# Altium project 2mL Smart Parts Storage V1.PrjPcb
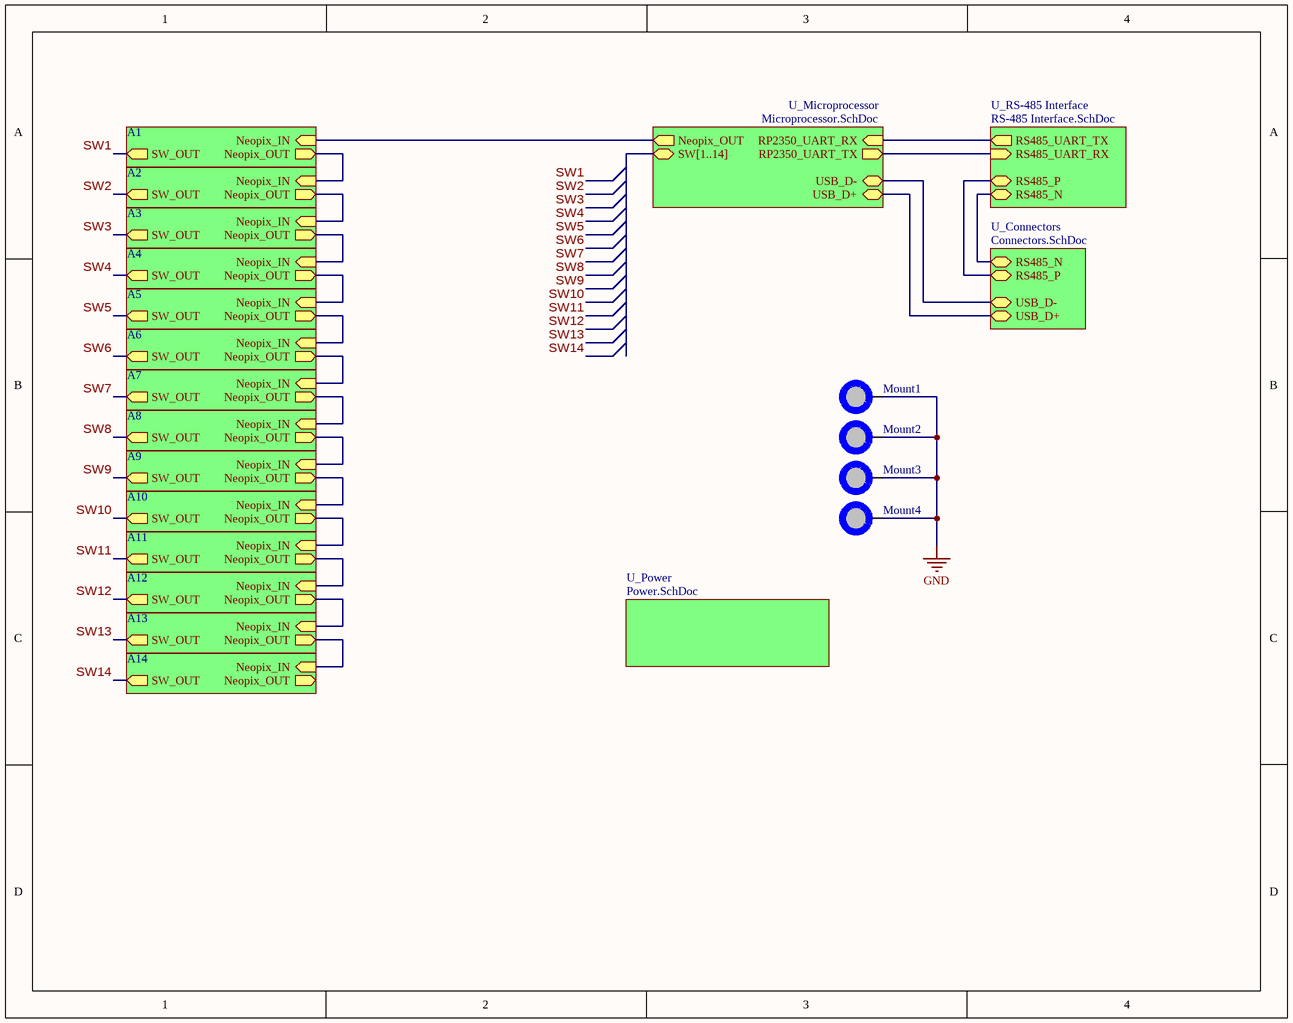
[diagram p0: Top Level.SchDoc]
6 sheets, 83 parts. Net scope: hierarchical (ports join the sheet entries above them; power ports are global).
Board file: Layout.PcbDoc
Sheets:
  Top Level.SchDoc
    U_Microprocessor = Microprocessor.SchDoc
    U_Connectors = Connectors.SchDoc
    U_RS-485 Interface = RS-485 Interface.SchDoc
    A1 = 2mL Socket.SchDoc
    A2 = 2mL Socket.SchDoc
    A3 = 2mL Socket.SchDoc
    A4 = 2mL Socket.SchDoc
    A5 = 2mL Socket.SchDoc
    A6 = 2mL Socket.SchDoc
    A7 = 2mL Socket.SchDoc
    A8 = 2mL Socket.SchDoc
    A9 = 2mL Socket.SchDoc
    A10 = 2mL Socket.SchDoc
    A11 = 2mL Socket.SchDoc
    A12 = 2mL Socket.SchDoc
    A13 = 2mL Socket.SchDoc
    A14 = 2mL Socket.SchDoc
    U_Power = Power.SchDoc

## Sheet Top Level.SchDoc
size A; SheetNumber: 1; SheetTotal: 6

### Parts
Mount1  M3 Mount Hole  [[Mount] M3 Mount Hole]  (value not drawn)  (no BOM)
Mount2  M3 Mount Hole  [[Mount] M3 Mount Hole]  (value not drawn)  (no BOM)
Mount3  M3 Mount Hole  [[Mount] M3 Mount Hole]  (value not drawn)  (no BOM)
Mount4  M3 Mount Hole  [[Mount] M3 Mount Hole]  (value not drawn)  (no BOM)

### Sub-sheets
A1 = 2mL Socket.SchDoc: SW_OUT (out), Neopix_IN (in), Neopix_OUT (out)
A2 = 2mL Socket.SchDoc: SW_OUT (out), Neopix_IN (in), Neopix_OUT (out)
A3 = 2mL Socket.SchDoc: SW_OUT (out), Neopix_IN (in), Neopix_OUT (out)
A4 = 2mL Socket.SchDoc: SW_OUT (out), Neopix_IN (in), Neopix_OUT (out)
A5 = 2mL Socket.SchDoc: SW_OUT (out), Neopix_IN (in), Neopix_OUT (out)
A6 = 2mL Socket.SchDoc: SW_OUT (out), Neopix_IN (in), Neopix_OUT (out)
A7 = 2mL Socket.SchDoc: SW_OUT (out), Neopix_IN (in), Neopix_OUT (out)
A8 = 2mL Socket.SchDoc: SW_OUT (out), Neopix_IN (in), Neopix_OUT (out)
A9 = 2mL Socket.SchDoc: SW_OUT (out), Neopix_IN (in), Neopix_OUT (out)
A10 = 2mL Socket.SchDoc: SW_OUT (out), Neopix_IN (in), Neopix_OUT (out)
A11 = 2mL Socket.SchDoc: SW_OUT (out), Neopix_IN (in), Neopix_OUT (out)
A12 = 2mL Socket.SchDoc: SW_OUT (out), Neopix_IN (in), Neopix_OUT (out)
A13 = 2mL Socket.SchDoc: SW_OUT (out), Neopix_IN (in), Neopix_OUT (out)
A14 = 2mL Socket.SchDoc: SW_OUT (out), Neopix_IN (in), Neopix_OUT (out)
U_Connectors = Connectors.SchDoc: RS485_P (bidir), RS485_N (bidir), USB_D+ (bidir), USB_D- (bidir)
U_Microprocessor = Microprocessor.SchDoc: SW[1..14] (bidir), RP2350_UART_RX (in), RP2350_UART_TX (out), Neopix_OUT (out), USB_D+ (bidir), USB_D- (bidir)
U_Power = Power.SchDoc: no entries
U_RS-485 Interface = RS-485 Interface.SchDoc: RS485_UART_TX (out), RS485_UART_RX (in), RS485_P (bidir), RS485_N (bidir)

### Nets
GND: Mount1.1 Mount2.1 Mount3.1 Mount4.1
RP2350_D_N: sheet U_Microprocessor/USB_D-, sheet U_Connectors/USB_D-
RP2350_D_P: sheet U_Microprocessor/USB_D+, sheet U_Connectors/USB_D+
RS485_N: sheet U_Connectors/RS485_N, sheet U_RS-485 Interface/RS485_N
RS485_P: sheet U_Connectors/RS485_P, sheet U_RS-485 Interface/RS485_P
RS485_RX: sheet U_Microprocessor/RP2350_UART_TX, sheet U_RS-485 Interface/RS485_UART_RX
RS485_TX: sheet U_Microprocessor/RP2350_UART_RX, sheet U_RS-485 Interface/RS485_UART_TX
SW1: sheet A1/SW_OUT
SW2: sheet A2/SW_OUT
SW3: sheet A3/SW_OUT
SW4: sheet A4/SW_OUT
SW5: sheet A5/SW_OUT
SW6: sheet A6/SW_OUT
SW7: sheet A7/SW_OUT
SW8: sheet A8/SW_OUT
SW9: sheet A9/SW_OUT
SW10: sheet A10/SW_OUT
SW11: sheet A11/SW_OUT
SW12: sheet A12/SW_OUT
SW13: sheet A13/SW_OUT
SW14: sheet A14/SW_OUT
(unnamed): sheet U_Microprocessor/Neopix_OUT, sheet A1/Neopix_IN
(unnamed): sheet A1/Neopix_OUT, sheet A2/Neopix_IN
(unnamed): sheet A2/Neopix_OUT, sheet A3/Neopix_IN
(unnamed): sheet A3/Neopix_OUT, sheet A4/Neopix_IN
(unnamed): sheet A4/Neopix_OUT, sheet A5/Neopix_IN
(unnamed): sheet A5/Neopix_OUT, sheet A6/Neopix_IN
(unnamed): sheet A6/Neopix_OUT, sheet A7/Neopix_IN
(unnamed): sheet A7/Neopix_OUT, sheet A8/Neopix_IN
(unnamed): sheet A8/Neopix_OUT, sheet A9/Neopix_IN
(unnamed): sheet A9/Neopix_OUT, sheet A10/Neopix_IN
(unnamed): sheet A10/Neopix_OUT, sheet A11/Neopix_IN
(unnamed): sheet A11/Neopix_OUT, sheet A12/Neopix_IN
(unnamed): sheet A12/Neopix_OUT, sheet A13/Neopix_IN
(unnamed): sheet A13/Neopix_OUT, sheet A14/Neopix_IN

### Library data of the parts
Mount1-Mount4 = [Mount] M3 Mount Hole: Place at least 4.5mm from board edge. Plated.

## Sheet Microprocessor.SchDoc
size B; SheetNumber: 2; SheetTotal: 2
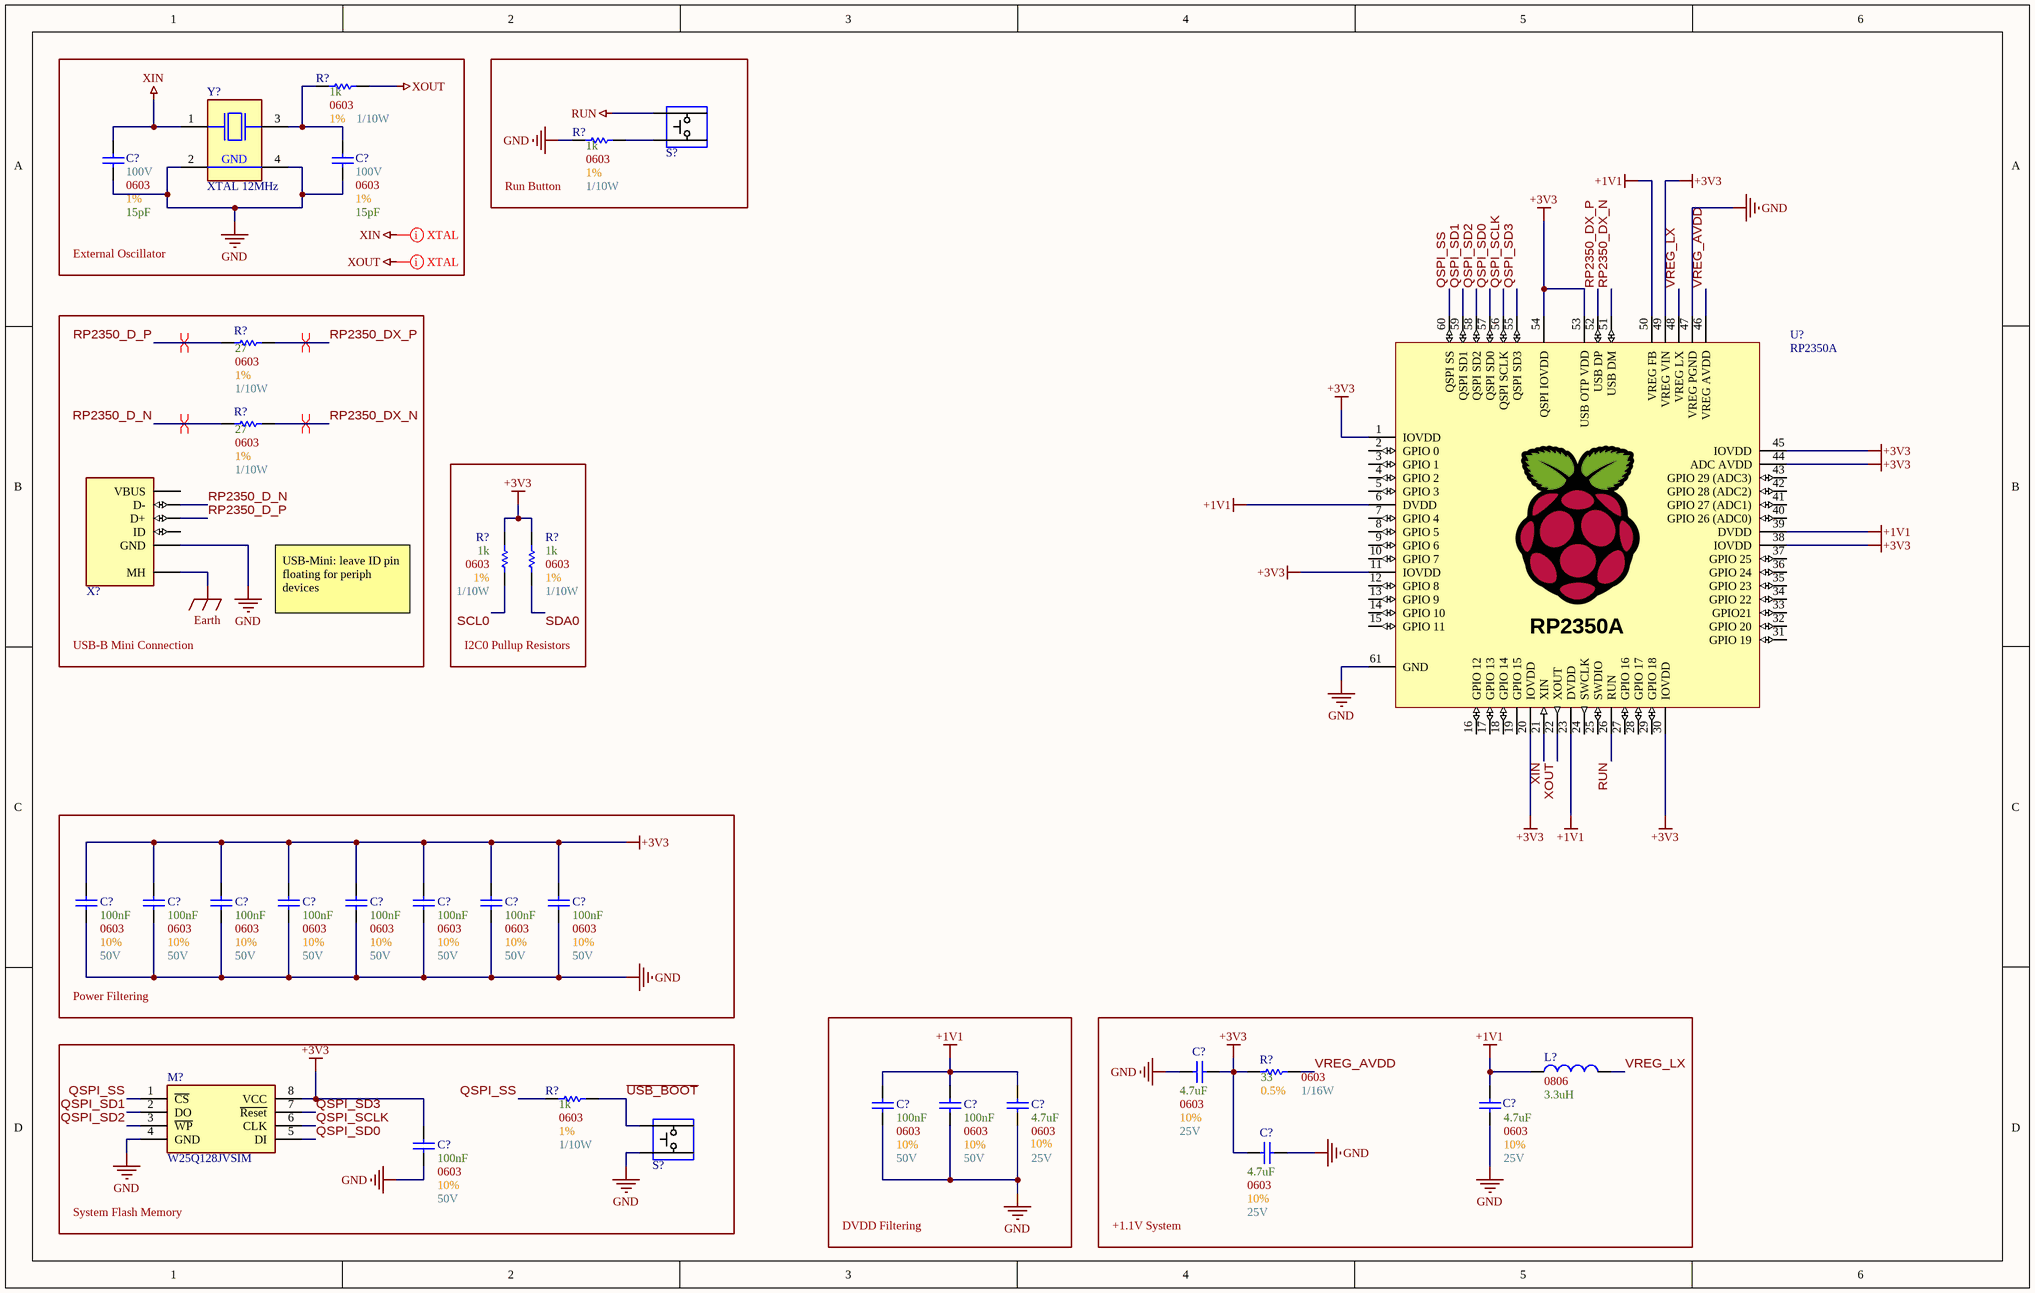
[diagram p1: Microprocessor.SchDoc]

### Parts
(Parts that share a designator on the sheet are numbered #1, #2 ... from top to bottom, then left to right.)
C1  Max Voltage: 100V  Size Package: 0603  Tolerance: 1%  Capacitance: 15pF  [[Cap] SMD 0603]  (hidden comment: [Cap] 0603 15pF 1% 100V)
C2  Max Voltage: 100V  Size Package: 0603  Tolerance: 1%  Capacitance: 15pF  [[Cap] SMD 0603]  (hidden comment: [Cap] 0603 15pF 1% 100V)
C3  Max Voltage: 50V  Size Package: 0603  Tolerance: 10%  Capacitance: 100nF  [[Cap] SMD 0603]  (hidden comment: [Cap] 0603 0.1uF 10% 50V)
C4  Max Voltage: 50V  Size Package: 0603  Tolerance: 10%  Capacitance: 100nF  [[Cap] SMD 0603]  (hidden comment: [Cap] 0603 0.1uF 10% 50V)
C5  Max Voltage: 50V  Size Package: 0603  Tolerance: 10%  Capacitance: 100nF  [[Cap] SMD 0603]  (hidden comment: [Cap] 0603 0.1uF 10% 50V)
C6  Max Voltage: 50V  Size Package: 0603  Tolerance: 10%  Capacitance: 100nF  [[Cap] SMD 0603]  (hidden comment: [Cap] 0603 0.1uF 10% 50V)
C7  Max Voltage: 50V  Size Package: 0603  Tolerance: 10%  Capacitance: 100nF  [[Cap] SMD 0603]  (hidden comment: [Cap] 0603 0.1uF 10% 50V)
C8  Max Voltage: 50V  Size Package: 0603  Tolerance: 10%  Capacitance: 100nF  [[Cap] SMD 0603]  (hidden comment: [Cap] 0603 0.1uF 10% 50V)
C9  Max Voltage: 50V  Size Package: 0603  Tolerance: 10%  Capacitance: 100nF  [[Cap] SMD 0603]  (hidden comment: [Cap] 0603 0.1uF 10% 50V)
C10  Max Voltage: 50V  Size Package: 0603  Tolerance: 10%  Capacitance: 100nF  [[Cap] SMD 0603]  (hidden comment: [Cap] 0603 0.1uF 10% 50V)
C11  Max Voltage: 25V  Size Package: 0603  Tolerance: 10%  Capacitance: 4.7uF  [[Cap] SMD 0603]  (hidden comment: [Cap] 0603 4.7uF 10% 25V)
C12  Max Voltage: 50V  Size Package: 0603  Tolerance: 10%  Capacitance: 100nF  [[Cap] SMD 0603]  (hidden comment: [Cap] 0603 0.1uF 10% 50V)
C13  Max Voltage: 50V  Size Package: 0603  Tolerance: 10%  Capacitance: 100nF  [[Cap] SMD 0603]  (hidden comment: [Cap] 0603 0.1uF 10% 50V)
C14  Max Voltage: 25V  Size Package: 0603  Tolerance: 10%  Capacitance: 4.7uF  [[Cap] SMD 0603]  (hidden comment: [Cap] 0603 4.7uF 10% 25V)
C15  Max Voltage: 25V  Size Package: 0603  Tolerance: 10%  Capacitance: 4.7uF  [[Cap] SMD 0603]  (hidden comment: [Cap] 0603 4.7uF 10% 25V)
C16  Max Voltage: 25V  Size Package: 0603  Tolerance: 10%  Capacitance: 4.7uF  [[Cap] SMD 0603]  (hidden comment: [Cap] 0603 4.7uF 10% 25V)
C17  Max Voltage: 50V  Size Package: 0603  Tolerance: 10%  Capacitance: 100nF  [[Cap] SMD 0603]  (hidden comment: [Cap] 0603 0.1uF 10% 50V)
L1  Package: 0806  Inductance: 3.3uH  [[Inductor] SMD 0806]  (hidden comment: [3.3uH] SMD 0806 2.1A)
M1  W25Q128JVSIM  [[Flash] 128MBit]
R2  Wattage: 1/10W  Tolerance: 1%  Resistance: 1k  Size Package: 0603  [[Res] SMD 0603]  (hidden comment: [1k] SMD 0603 1% 1/10W)
R4  Wattage: 1/10W  Tolerance: 1%  Resistance: 27  Size Package: 0603  [[Res] SMD 0603]  (hidden comment: [27] SMD 0603 1% 1/10W)
R5  Wattage: 1/10W  Tolerance: 1%  Resistance: 27  Size Package: 0603  [[Res] SMD 0603]  (hidden comment: [27] SMD 0603 1% 1/10W)
R6  Wattage: 1/16W  Tolerance: 0.5%  Resistance: 33  Size Package: 0603  [[Res] SMD 0603]  (hidden comment: [33] SMD 0603 0.5% 1/16W)
R7  Wattage: 1/10W  Tolerance: 1%  Resistance: 1k  Size Package: 0603  [[Res] SMD 0603]  (hidden comment: [1k] SMD 0603 1% 1/10W)
R?#1  Wattage: 1/10W  Tolerance: 1%  Resistance: 1k  Size Package: 0603  [[Res] SMD 0603]  (hidden comment: [1k] SMD 0603 1% 1/10W)
R?#2  Wattage: 1/10W  Tolerance: 1%  Resistance: 1k  Size Package: 0603  [[Res] SMD 0603]  (hidden comment: [1k] SMD 0603 1% 1/10W)
R?#3  Wattage: 1/10W  Tolerance: 1%  Resistance: 1k  Size Package: 0603  [[Res] SMD 0603]  (hidden comment: [1k] SMD 0603 1% 1/10W)
S?#1  Standard pushbutton  [[SPST] Pushbutton]  (value not drawn)
S?#2  Standard pushbutton  [[SPST] Pushbutton]  (value not drawn)
U1  RP2350A  [[MCU] RP2350A]
X?  [USB] Type-B Mini  [[USB] Type-B Mini]  (value not drawn)
Y1  XTAL 12MHz  [[Crystal] SMD 12MHz]

### Blocks framed on the sheet
External Oscillator: C1 C2 R2 Y1
Run Button: R?#1 S?#1
USB-B Mini Connection: R4 R5 X?
I2C0 Pullup Resistors: R?#2 R?#3
Power Filtering: C3-C10
DVDD Filtering: C12-C14
+1.1V System: C11 C15 C16 L1 R6
System Flash Memory: C17 M1 R7 S?#2

### Nets
+1V1: C12.2 C13.2 C14.2 C15.1 L1.1 U1.6(DVDD) U1.23(DVDD) U1.39(DVDD) U1.50(VREG_FB)
+3V3: C3.2 C4.2 C5.2 C6.2 C7.2 C8.2 C9.2 C10.2 C11.1 C16.2 C17.2 M1.8(VCC) R6.1 R?#2.2 R?#3.2 U1.1(IOVDD) U1.11(IOVDD) U1.20(IOVDD) U1.30(IOVDD) U1.38(IOVDD) U1.44(ADC_AVDD) U1.45(IOVDD) U1.49(VREG_VIN) U1.53(USB_OTP_VDD) U1.54(QSPI_IOVDD)
Earth: X?.MH
GND: C1.1 C2.1 C3.1 C4.1 C5.1 C6.1 C7.1 C8.1 C9.1 C10.1 C11.2 C12.1 C13.1 C14.1 C15.2 C16.1 C17.1 M1.4(GND) R?#1.1 S?#2.2 U1.47(VREG_PGND) U1.61(GND) X?.5(GND) Y1.2(GND) Y1.4(GND)
RUN: S?#1.1 U1.26(RUN)
XIN: C1.2 U1.21(XIN) Y1.1(XTAL1)
XOUT: R2.2 U1.22(XOUT)
QSPI_SCLK: M1.6(CLK) U1.56(QSPI_SCLK)
QSPI_SD0: M1.5(DI) U1.57(QSPI_SD0)
QSPI_SD1: M1.2(DO) U1.59(QSPI_SD1)
QSPI_SD2: M1.3(~{WP}) U1.58(QSPI_SD2)
QSPI_SD3: M1.7(~{Reset}) U1.55(QSPI_SD3)
QSPI_SS: M1.1(~{CS}) R7.1 U1.60(QSPI_SS)
RP2350_D_N: R5.1 X?.2(D-)
RP2350_D_P: R4.1 X?.3(D+)
RP2350_DX_N: R5.2 U1.51(USB_DM)
RP2350_DX_P: R4.2 U1.52(USB_DP)
SCL0: R?#2.1
SDA0: R?#3.1
~{USB_BOOT}: R7.2 S?#2.1
VREG_AVDD: R6.2 U1.46(VREG_AVDD)
VREG_LX: L1.2 U1.48(VREG_LX)
NetC2_2: C2.2 R2.1 Y1.3(XTAL2)
NetR?#1_2: R?#1.2 S?#1.2

Not connected (* = marked no-connect by the designer): U1 2(GPIO_0) 3(GPIO_1) 4(GPIO_2) 5(GPIO_3) 7(GPIO_4) 8(GPIO_5) 9(GPIO_6) 10(GPIO_7) 12(GPIO_8) 13(GPIO_9) 14(GPIO_10) 15(GPIO_11) 16(GPIO_12) 17(GPIO_13) 18(GPIO_14) 19(GPIO_15) 24(SWCLK) 25(SWDIO) 27(GPIO_16) 28(GPIO_17) 29(GPIO_18) 31(GPIO_19) 32(GPIO_20) 33(GPIO21) 34(GPIO_22) 35(GPIO_23) 36(GPIO_24) 37(GPIO_25) 40(GPIO_26_(ADC0)) 41(GPIO_27_(ADC1)) 42(GPIO_28_(ADC2)) 43(GPIO_29_(ADC3)); X? 1(VBUS) 4(ID)

### Layout directives
differential pair; differential pair class USB_Pairs: RP2350_D_N, RP2350_D_P, RP2350_DX_N, RP2350_DX_P
net class XTAL_Nets: XIN, XOUT

### Notes on the sheet
- USB-Mini: leave ID pin floating for periph devices
- Labels drawn without touching a wire or pin: XIN, XOUT

### Library data of the parts
C1 C2 = [Cap] 0603 15pF 1% 100V: GCM1885C2A150FA16D; Supplier 1: DigiKey; Supplier Part Number 1: 490-16416-1-ND
C3-C10 C12 C13 C17 = [Cap] 0603 0.1uF 10% 50V: CL10B104KB8NNNC; Supplier 1: DigiKey; Supplier Part Number 1: 1276-1000-6-ND
C11 C14-C16 = [Cap] 0603 4.7uF 10% 25V: GRM188R61E475KE11D; Supplier 1: DigiKey; Supplier Part Number 1: 490-7203-6-ND
L1 = [3.3uH] SMD 0806 2.1A: AOTA-B201610S3R3-101-T; Supplier 1: DigiKey; Supplier Part Number 1: 535-AOTA-B201610S3R3-101-TCT-ND
M1 = [Flash] 128MBit: Supplier 1: DigiKey; Supplier Part Number 1: W25Q128JVSIM-ND
R2 R7 R?#1-R?#3 = [1k] SMD 0603 1% 1/10W: RMCF0603FT1K00; Supplier 1: DigiKey; Supplier Part Number 1: RMCF0603FT1K00DKR-ND
R4 R5 = [27] SMD 0603 1% 1/10W: MCT06030C2709FP500; Supplier 1: DigiKey; Supplier Part Number 1: 749-1631-1-ND
R6 = [33] SMD 0603 0.5% 1/16W: RR0816Q-330-D; Supplier 1: DigiKey; Supplier Part Number 1: RR08Q33DDKR-ND
S?#1 S?#2 = [SPST] Pushbutton: Supplier 1: DigiKey; Supplier Part Number 1: 450-1650-ND
U1 = [MCU] RP2350A: QFN-60 Package; Supplier 1: DigiKey; Supplier Part Number 1: 2648-SC1509-A4CT-ND
X? = [USB] Type-B Mini: MUSB-05-S-B-SM-A-K-TR; Supplier 1: DigiKey; Supplier Part Number 1: SAM14226CT-ND
Y1 = [Crystal] SMD 12MHz: 815-ABM8-272-T3; Supplier 1: DigiKey; Supplier Part Number 1: 535-ABM8-272-T3CT-ND

## Sheet Connectors.SchDoc
size A; SheetNumber: 4; SheetTotal: 6
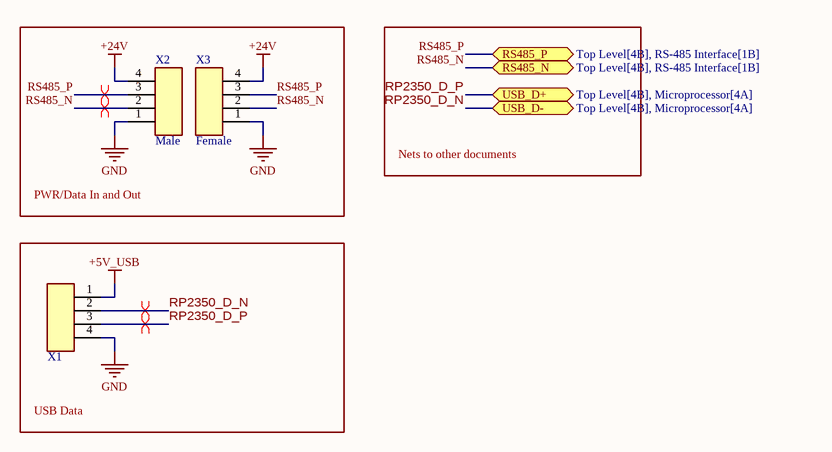
[diagram p2: Connectors.SchDoc]

### Parts
X1  [Sherlock] 4pin  [[Sherlock] 4pin]  (value not drawn)
X2  Male  [[Pogo] Magnetic Right-Angle 4pos Male]
X3  Female  [[Pogo] Magnetic Right-Angle 4pos Female]

### Blocks framed on the sheet
PWR/Data In and Out: X2 X3
USB Data: X1

### Ports
RS485_N (bidir, see Top Level[4B], RS-485 Interface[1B]), RS485_P (bidir, see Top Level[4B], RS-485 Interface[1B]), USB_D+ (bidir, see Top Level[4B], Microprocessor[4A]), USB_D- (bidir, see Top Level[4B], Microprocessor[4A])

### Nets
+5V_USB: X1.1
+24V: X2.4 X3.4
GND: X1.4 X2.1 X3.1
RP2350_D_N: X1.2 ; port USB_D-
RP2350_D_P: X1.3 ; port USB_D+
RS485_N: X2.2 X3.2 ; port RS485_N
RS485_P: X2.3 X3.3 ; port RS485_P

### Layout directives
differential pair; differential pair class USB_Pairs: RP2350_D_N, RP2350_D_P
differential pair; differential pair class RS485_Pairs: RS485_N, RS485_P

### Notes on the sheet
- Nets to other documents

### Library data of the parts
X1 = [Sherlock] 4pin: 0353620450; Supplier 1: DigiKey; Supplier Part Number 1: WM18922-ND
X2 = [Pogo] Magnetic Right-Angle 4pos Male: 5358; Supplier 1: DigiKey; Supplier Part Number 1: 1528-5358-ND
X3 = [Pogo] Magnetic Right-Angle 4pos Female: 5358; Supplier 1: DigiKey; Supplier Part Number 1: 1528-5358-ND

## Sheet RS-485 Interface.SchDoc
size A; SheetNumber: 6; SheetTotal: 6
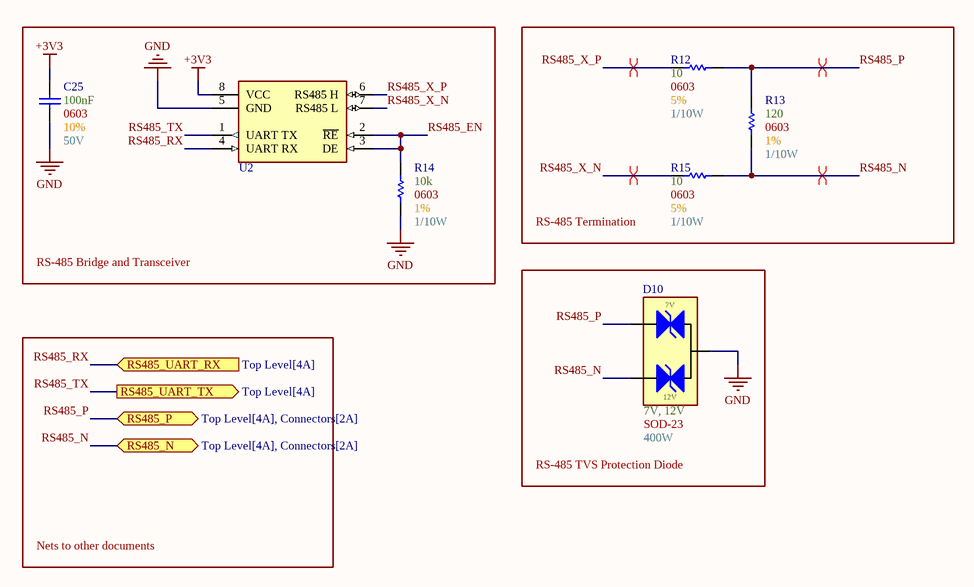
[diagram p3: RS-485 Interface.SchDoc]

### Parts
C25  Max Voltage: 50V  Size Package: 0603  Tolerance: 10%  Capacitance: 100nF  [[Cap] SMD 0603]  (hidden comment: [Cap] 0603 0.1uF 10% 50V)
D10  Wattage: 400W  Optimal Zener Voltage: 7V, 12V  [[Diode] SOD-23]  (hidden comment: SOD-23)
R12  Wattage: 1/10W  Tolerance: 5%  Resistance: 10  Size Package: 0603  [[Res] SMD 0603]  (hidden comment: [10] SMD 0603 5% 1/10W)
R13  Wattage: 1/10W  Tolerance: 1%  Resistance: 120  Size Package: 0603  [[Res] SMD 0603]  (hidden comment: [120] SMD 0603 1% 1/10W)
R14  Wattage: 1/10W  Tolerance: 1%  Resistance: 10k  Size Package: 0603  [[Res] SMD 0603]  (hidden comment: [10k] SMD 0603 1% 1/10W)
R15  Wattage: 1/10W  Tolerance: 5%  Resistance: 10  Size Package: 0603  [[Res] SMD 0603]  (hidden comment: [10] SMD 0603 5% 1/10W)
U2  [Bridge] UART-RS485  [8-SOIC]  (value not drawn)

### Blocks framed on the sheet
RS-485 Bridge and Transceiver: C25 R14 U2
RS-485 Termination: R12 R13 R15
RS-485 TVS Protection Diode: D10

### Ports
RS485_N (bidir, see Top Level[4A], Connectors[2A]), RS485_P (bidir, see Top Level[4A], Connectors[2A]), RS485_UART_RX (in, see Top Level[4A]), RS485_UART_TX (out, see Top Level[4A])

### Nets
+3V3: C25.2 U2.8(VCC)
GND: C25.1 D10.3 R14.1 U2.5(GND)
RS485_EN: R14.2 U2.2(~{RE}) U2.3(DE)
RS485_N: D10.2 R13.1 R15.1 ; port RS485_N
RS485_P: D10.1 R12.1 R13.2 ; port RS485_P
RS485_RX: U2.4(UART_RX) ; port RS485_UART_RX
RS485_TX: U2.1(UART_TX) ; port RS485_UART_TX
RS485_X_N: R15.2 U2.7(RS485_L)
RS485_X_P: R12.2 U2.6(RS485_H)

### Layout directives
differential pair: RS485_N, RS485_P, RS485_X_N, RS485_X_P

### Notes on the sheet
- Nets to other documents
- (in symbol [TVS] 7,12Vnom 11,19Vclamp_max) 7V; 12V

### Library data of the parts
C25 = [Cap] 0603 0.1uF 10% 50V: CL10B104KB8NNNC; Supplier 1: DigiKey; Supplier Part Number 1: 1276-1000-6-ND
D10 = [TVS] 7,12Vnom 11,19Vclamp_max: CDSOT23-SM712; Supplier 1: DigiKey; Supplier Part Number 1: CDSOT23-SM712CT-ND; Footprint: SOD-23
R12 R15 = [10] SMD 0603 5% 1/10W: RC0603JR-1310RL; Supplier 1: DigiKey; Supplier Part Number 1: 13-RC0603JR-1310RLDKR-ND
R13 = [120] SMD 0603 1% 1/10W: RC0603FR-07120RL; Supplier 1: DigiKey; Supplier Part Number 1: 311-120HRDKR-ND
R14 = [10k] SMD 0603 1% 1/10W: RMCF0603FT10K0; Supplier 1: DigiKey; Supplier Part Number 1: RMCF0603FT10K0DKR-ND
U2 = [Bridge] UART-RS485: THVD1400DR; Supplier 1: DigiKey; Supplier Part Number 1: 296-THVD1400DRCT-ND

## Sheet 2mL Socket.SchDoc
size A; SheetNumber: 1; SheetTotal: 1
Used 14 times, as channels A1, A2, A3, A4, A5, A6, A7, A8, A9, A10, A11, A12, A13, A14. Parts and nets are listed once, with the designators drawn on the sheet.
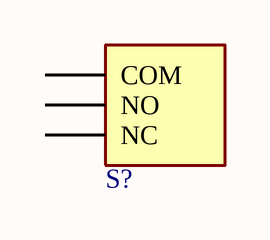
[diagram p4: 2mL Socket.SchDoc]

### Parts
S?  Custom Part  [[Limit Switch] SPDT Limit Switch Carrier Board]  (value not drawn)

### Nets

Not connected (* = marked no-connect by the designer): S? 1(COM) 2(NO) 3(NC)

### Channels
A1: designators end in _A1
A2: designators end in _A2
A3: designators end in _A3
A4: designators end in _A4
A5: designators end in _A5
A6: designators end in _A6
A7: designators end in _A7
A8: designators end in _A8
A9: designators end in _A9
A10: designators end in _A10
A11: designators end in _A11
A12: designators end in _A12
A13: designators end in _A13
A14: designators end in _A14

### Library data of the parts
S? = [Limit Switch] SPDT Limit Switch Carrier Board: Custom PCB

## Sheet Power.SchDoc
size B; SheetNumber: 5; SheetTotal: 6
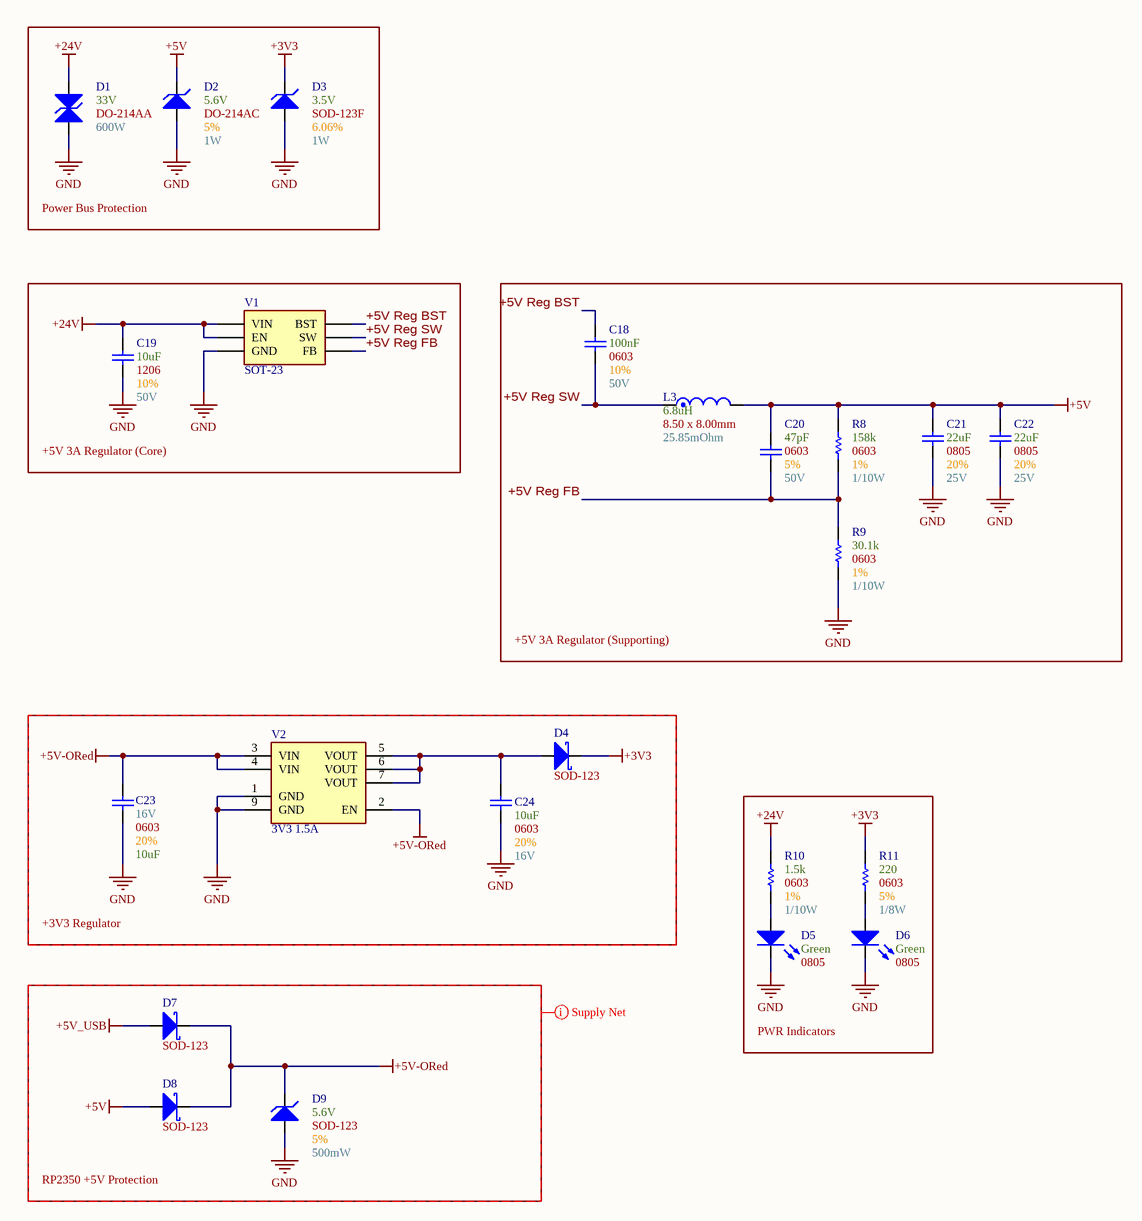
[diagram p5: Power.SchDoc]

### Parts
C18  Max Voltage: 50V  Size Package: 0603  Tolerance: 10%  Capacitance: 100nF  [[Cap] SMD 0603]  (hidden comment: [Cap] 0603 0.1uF 10% 50V)
C19  Max Voltage: 50V  Size Package: 1206  Tolerance: 10%  Capacitance: 10uF  [[Cap] SMD 1206]  (hidden comment: [Cap] 1206 10uF 20% 50V)
C20  Max Voltage: 50V  Size Package: 0603  Tolerance: 5%  Capacitance: 47pF  [[Cap] SMD 0603]  (hidden comment: [Cap] 0603 47pF 5% 50V)
C21  Max Voltage: 25V  Size Package: 0805  Tolerance: 20%  Capacitance: 22uF  [[Cap] SMD 0805]  (hidden comment: [Cap] 0805 22uF 20% 25V)
C22  Max Voltage: 25V  Size Package: 0805  Tolerance: 20%  Capacitance: 22uF  [[Cap] SMD 0805]  (hidden comment: [Cap] 0805 22uF 20% 25V)
C23  Max Voltage: 16V  Size Package: 0603  Tolerance: 20%  Capacitance: 10uF  [[Cap] SMD 0603]  (hidden comment: [Cap] 0603 10uF 20% 16V)
C24  Max Voltage: 16V  Size Package: 0603  Tolerance: 20%  Capacitance: 10uF  [[Cap] SMD 0603]  (hidden comment: [Cap] 0603 10uF 20% 16V)
D1  Wattage: 600W  Optimal Zener Voltage: 33V  [[Diode] SMD DO-214AA]  (hidden comment: DO-214AA)
D2  Tolerance: 5%  Wattage: 1W  Optimal Zener Voltage: 5.6V  [[Diode] SMD DO-214AC]  (hidden comment: DO-214AC)
D3  Tolerance: 6.06%  Wattage: 1W  Optimal Zener Voltage: 3.5V  [[Diode] SOD-123F]  (hidden comment: SOD-123F)
D4  Footprint: SOD-123  [[Diode] SMD SOD-123]  (hidden comment: SOD123)
D5  Color: Green  Size Package: 0805  [[LED] SMD 0805]  (hidden comment: [LED] SMD 0805 Green)
D6  Color: Green  Size Package: 0805  [[LED] SMD 0805]  (hidden comment: [LED] SMD 0805 Green)
D7  Footprint: SOD-123  [[Diode] SMD SOD-123]  (hidden comment: SOD123)
D8  Footprint: SOD-123  [[Diode] SMD SOD-123]  (hidden comment: SOD123)
D9  Tolerance: 5%  Wattage: 500mW  Optimal Zener Voltage: 5.6V  [[Diode] SMD SOD-123]  (hidden comment: SOD-123)
L3  DC Resistance: 25.85mOhm  Package: 8.50 x 8.00mm  Inductance: 6.8uH  [[6.8uH] SMD Nonstandard 6.9A]  (hidden comment: [6.8uH] SMD Nonstandard 6.9A)
R8  Wattage: 1/10W  Tolerance: 1%  Resistance: 158k  Size Package: 0603  [[Res] SMD 0603]  (hidden comment: [158k] SMD 0603 1% 1/10W)
R9  Wattage: 1/10W  Tolerance: 1%  Resistance: 30.1k  Size Package: 0603  [[Res] SMD 0603]  (hidden comment: [30.1k] SMD 0603 1% 1/10W)
R10  Wattage: 1/10W  Tolerance: 1%  Resistance: 1.5k  Size Package: 0603  [[Res] SMD 0603]  (hidden comment: [1.5k] SMD 0603 1% 1/10W)
R11  Wattage: 1/8W  Tolerance: 5%  Resistance: 220  Size Package: 0603  [[Res] SMD 0603]  (hidden comment: [220] SMD 0603 5% 1/10W)
V1  SOT-23  [SOT-23]
V2  3V3 1.5A  [[Linear] 3V3 1.5A]

### Blocks framed on the sheet
Power Bus Protection: D1-D3
+5V 3A Regulator (Core): C19 V1
+5V 3A Regulator (Supporting): C18 C20-C22 L3 R8 R9
+3V3 Regulator: C23 C24 D4 V2
PWR Indicators: D5 D6 R10 R11
RP2350 +5V Protection: D7-D9

### Nets
+3V3: D3.1(K) D4.1(K) R11.2
+5V: C20.2 C21.2 C22.2 D2.1(K) D8.2(A) L3.2 R8.2
+5V-ORed: C23.2 D7.1(K) D8.1(K) D9.1(K) V2.2(EN) V2.3(VIN) V2.4(VIN)
+5V_USB: D7.2(A)
+24V: C19.2 D1.2(K) R10.2 V1.2(EN) V1.3(VIN)
GND: C19.1 C21.1 C22.1 C23.1 C24.1 D1.1(A) D2.2(A) D3.2(A) D5.2(Cathode) D6.2(Cathode) D9.2(A) R9.1 V1.4(GND) V2.1(GND) V2.9(GND)
+5V Reg BST: C18.2 V1.6(BST)
+5V Reg FB: C20.1 R8.1 R9.2 V1.1(FB)
+5V Reg SW: C18.1 L3.1 V1.5(SW)
NetC24_2: C24.2 D4.2(A) V2.5(VOUT) V2.6(VOUT) V2.7(VOUT)
NetD5_1: D5.1(Anode) R10.1
NetD6_1: D6.1(Anode) R11.1

### Layout directives
net class Supply_Nets: +5V, +5V-ORed, +5V_USB, GND

### Library data of the parts
C18 = [Cap] 0603 0.1uF 10% 50V: CL10B104KB8NNNC; Supplier 1: DigiKey; Supplier Part Number 1: 1276-1000-6-ND
C19 = [Cap] 1206 10uF 20% 50V: CGA5L3X5R1H106M160AB; Supplier 1: DigiKey; Supplier Part Number 1: 445-12883-6-ND
C20 = [Cap] 0603 47pF 5% 50V: CL10C470JB8NNNC; Supplier 1: DigiKey; Supplier Part Number 1: 1276-1037-6-ND
C21 C22 = [Cap] 0805 22uF 20% 25V: CL21A226MAYNNWE; Supplier 1: DigiKey; Supplier Part Number 1: 1276-CL21A226MAYNNWECT-ND
C23 C24 = [Cap] 0603 10uF 20% 16V: GRM188C81C106MA73D; Supplier 1: DigiKey; Supplier Part Number 1: 490-7198-1-ND
D1 = [TVS] SMBJ33CA: SMBJ33CA; Supplier 1: DigiKey; Supplier Part Number 1: SMBJ33CA-FDICT-ND; Footprint: DO-214AA
D2 = [Zener] SMD 5.6V 1W 5%: SMAZ5V6-13-F; Supplier 1: DigiKey; Supplier Part Number 1: SMAZ5V6-FDICT-ND; Footprint: DO-214AC
D3 = [Zener] SMD 3.5V 1W 6%: KDZVTR3.3B; Supplier 1: DigiKey; Supplier Part Number 1: 846-KDZVTR3.3BCT-ND; Footprint: SOD-123F
D4 D7 D8 = [Schottky] SMD 40V 1A: B5819W-TP; Supplier 1: DigiKey; Supplier Part Number 1: B5819W-TPMSCT-ND
D5 D6 = [LED] SMD 0805 Green: LG R971-KN-1-0-20-R18; Supplier 1: DigiKey; Supplier Part Number 1: 475-LGR971-KN-1CT-ND
D9 = [Zener] SMD 5.6V 1/2W 5%: CMHZ5232B TR PBFREE; Supplier 1: DigiKey; Footprint: SOD-123; Supplier Part Number 1: 1514-CMHZ5232BTRPBFREEDKR-ND
L3 = [6.8uH] SMD Nonstandard 6.9A: ETQ-P4M6R8KVK; Supplier 1: DigiKey; Supplier Part Number 1: P19775CT-ND
R8 = [158k] SMD 0603 1% 1/10W: RC0603FR-07158KL; Supplier 1: DigiKey; Supplier Part Number 1: 311-158KHRDKR-ND
R9 = [30.1k] SMD 0603 1% 1/10W: RC0603FR-0730K1L; Supplier 1: DigiKey; Supplier Part Number 1: 311-30.1KHRCT-ND
R10 = [1.5k] SMD 0603 1% 1/10W: CR0603-FX-1501ELF; Supplier 1: DigiKey; Supplier Part Number 1: 118-CR0603-FX-1501ELFCT-ND
R11 = [220] SMD 0603 5% 1/10W: RK73B1JTTD221J; Supplier 1: DigiKey; Supplier Part Number 1: 2019-RK73B1JTTD221JDKR-ND
V1 = [Switching] SMD 0.8-31V 3A: AP63301WU-7; Supplier 1: DigiKey; Supplier Part Number 1: 31-AP63301WU-7CT-ND
V2 = [Linear] SMD 3V3 1.5A: AP7362A-33SP-13; Supplier 1: DigiKey; Supplier Part Number 1: AP7362A-33SP-13DICT-ND

## Nets that join several sheets
+3V3: Microprocessor (25 pins), RS-485 Interface (C25.2 U2.8), Power (D3.1 D4.1 R11.2)
+5V_USB: Connectors (X1.1), Power (D7.2)
+24V: Connectors (X2.4 X3.4), Power (5 pins)
GND: Top Level (Mount1.1 Mount2.1 Mount3.1 Mount4.1), Microprocessor (25 pins), Connectors (X1.4 X2.1 X3.1), RS-485 Interface (C25.1 D10.3 R14.1 U2.5), Power (15 pins)
RS485_N: Connectors (X2.2 X3.2), RS-485 Interface (D10.2 R13.1 R15.1)
RS485_P: Connectors (X2.3 X3.3), RS-485 Interface (D10.1 R12.1 R13.2)